# EAGLE design circuito_control (EAGLE 6.5.0)
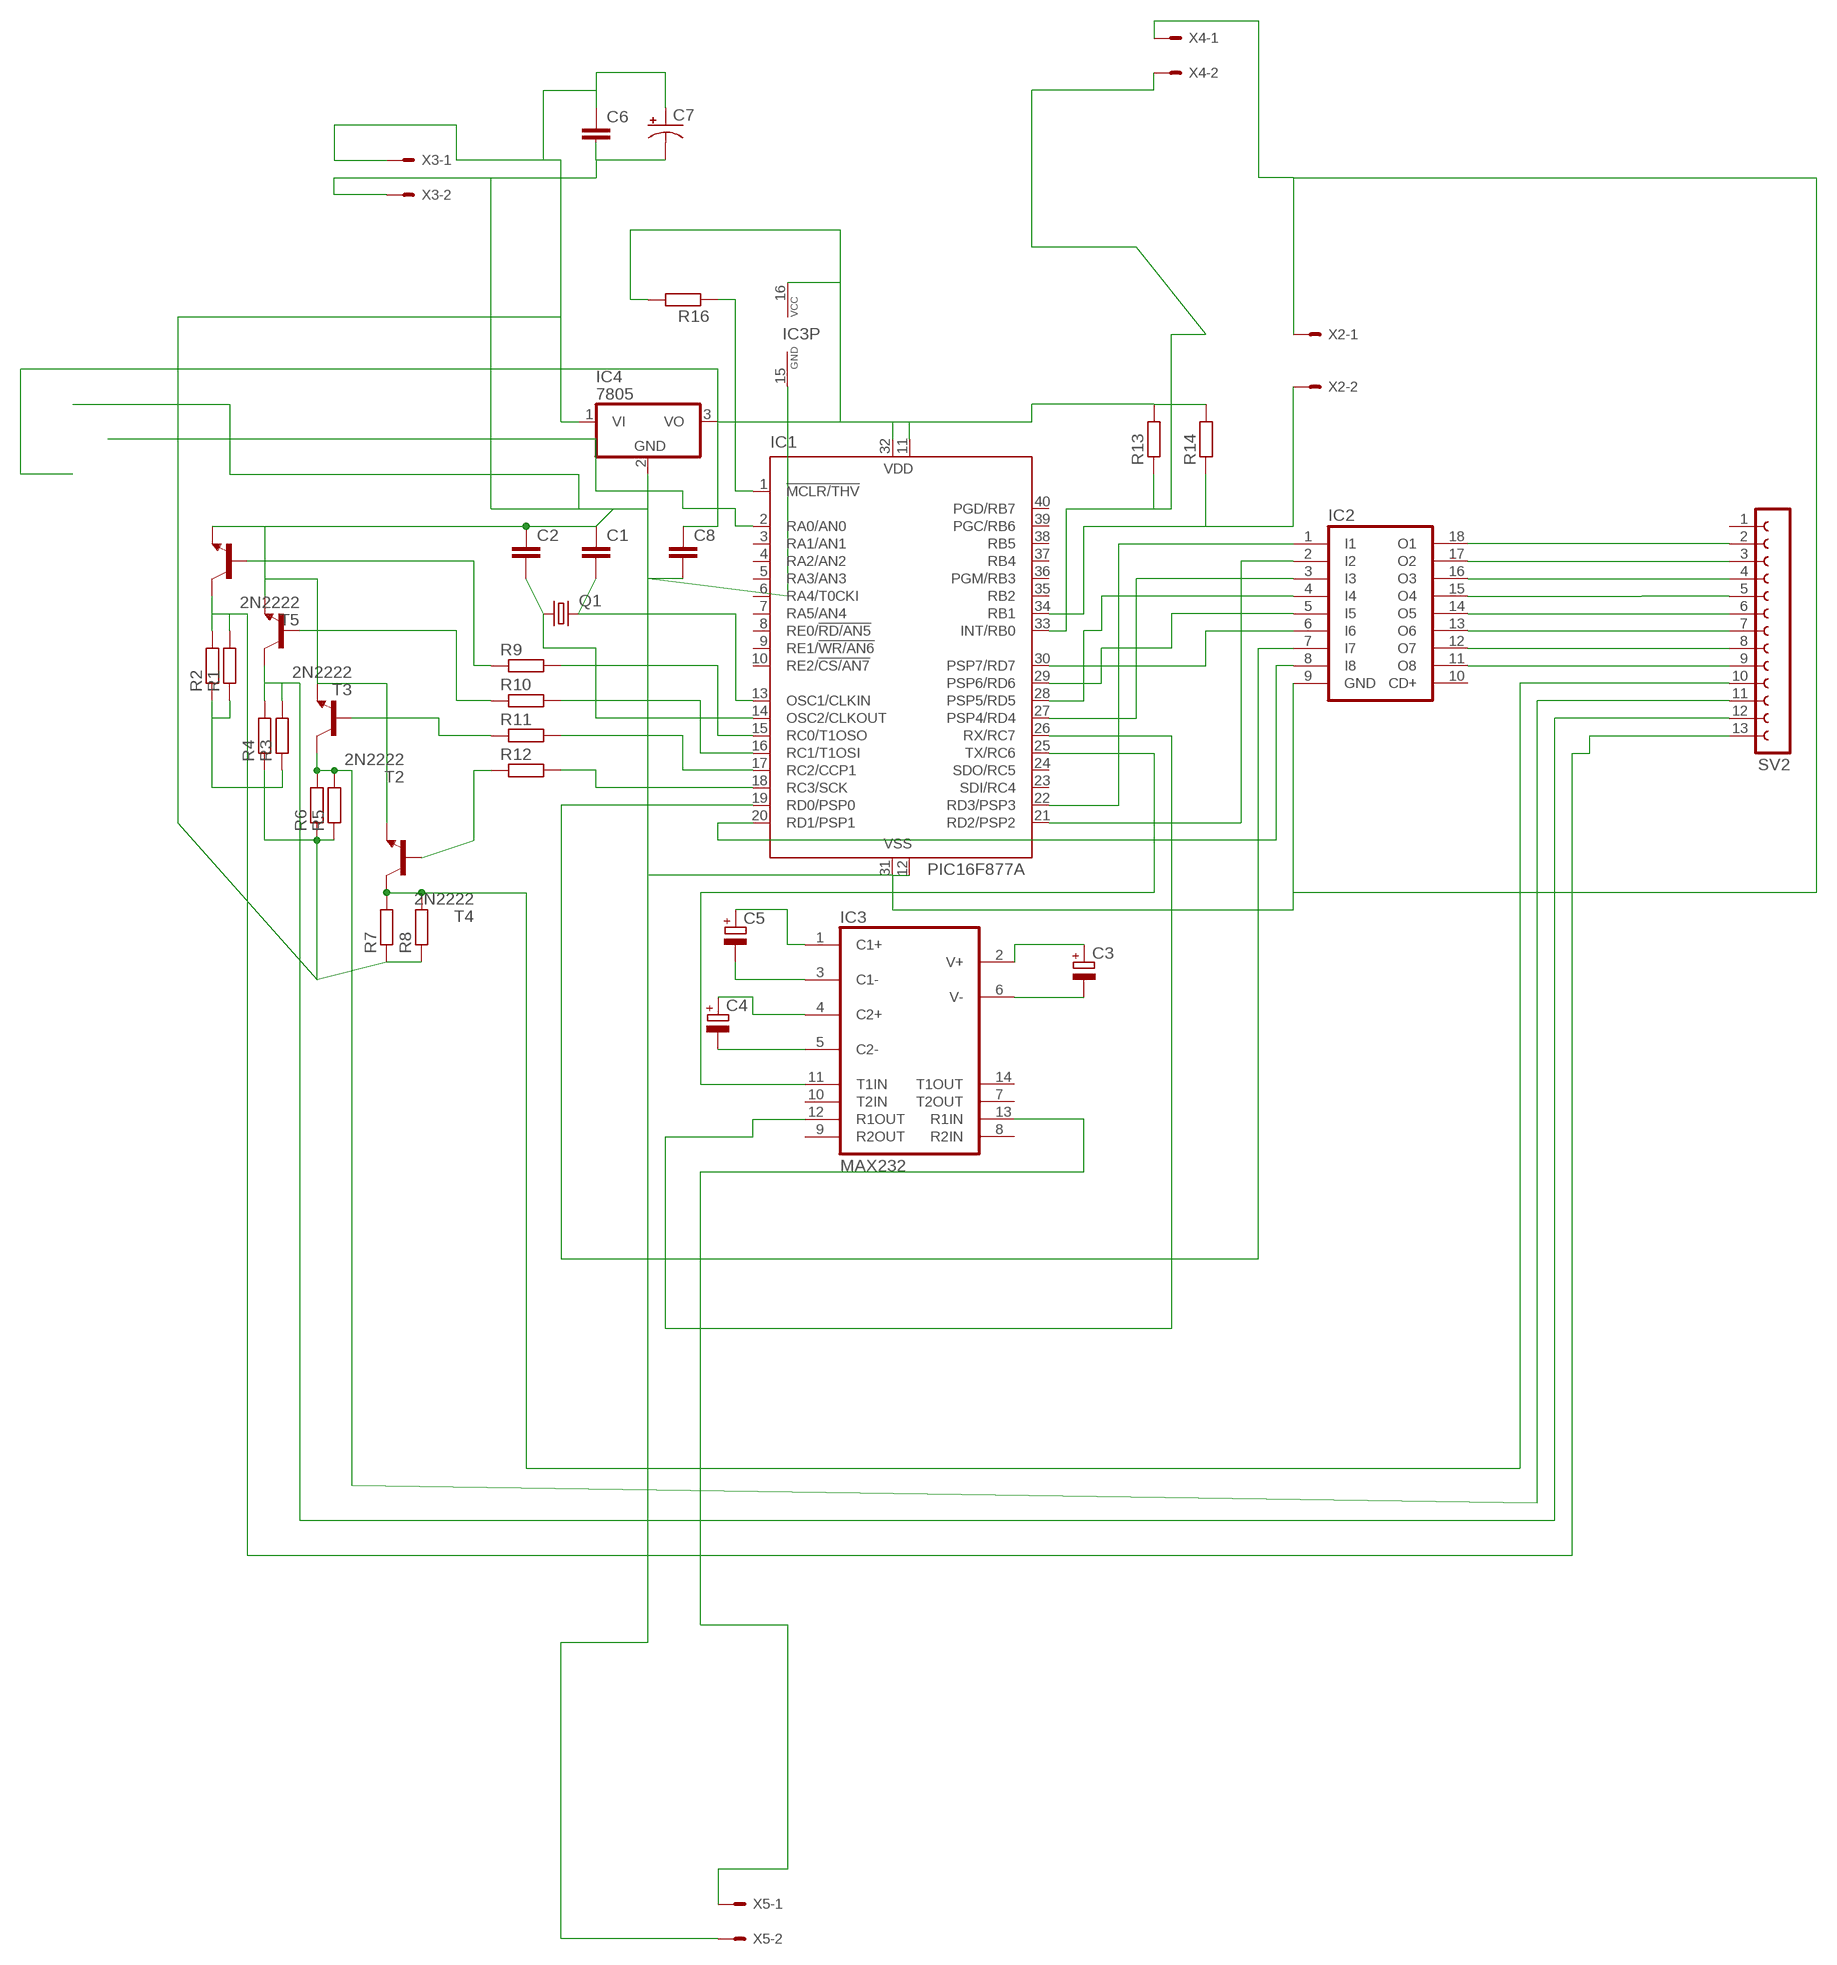
[diagram p0: schematic, sheet 1]

## Parts
C1  C-EU025-025X050  [C025-025X050]
C2  C-EU025-025X050  [C025-025X050]
C3  CPOL-EUE1.8-4  [E1,8-4]
C4  CPOL-EUE1.8-4  [E1,8-4]
C5  CPOL-EUE1.8-4  [E1,8-4]
C6  C-EU025-025X050  [C025-025X050]
C7  CPOL-USE5-10.5  [E5-10,5]
C8  C-EU025-025X050  [C025-025X050]
IC1  PIC16F877A  PIC16F877P  [DIL40]
IC2  ULN2803A  [DIL18]
IC3  MAX232  [DIL16]
IC4  7805  7805TV  [TO220V]
Q1  CRYSTALHC49U70  [HC49U70]
R1  R-EU_0411/15  [0411/15]
R2  R-EU_0411/15  [0411/15]
R3  R-EU_0411/15  [0411/15]
R4  R-EU_0411/15  [0411/15]
R5  R-EU_0411/15  [0411/15]
R6  R-EU_0411/15  [0411/15]
R7  R-EU_0411/15  [0411/15]
R8  R-EU_0411/15  [0411/15]
R9  R-EU_0207/7  [0207/7]
R10  R-EU_0207/7  [0207/7]
R11  R-EU_0207/7  [0207/7]
R12  R-EU_0207/7  [0207/7]
R13  R-EU_0207/7  [0207/7]
R14  R-EU_0207/7  [0207/7]
R16  R-EU_0207/7  [0207/7]
SV2  FE13-1  [FE13]
T2  2N2222  [TO18]
T3  2N2222  [TO18]
T4  2N2222  [TO18]
T5  2N2222  [TO18]
X2  KK-156-2  [KK-156-2]
X3  KK-156-2  [KK-156-2]
X4  KK-156-2  [KK-156-2]
X5  KK-156-2  [KK-156-2]

## Nets
N$1: C6.1 C7.+ IC4.1(VI) R1.1 R2.1 R3.1 R4.1 R5.1 R6.1 R7.1 R8.1 X3.1
N$2: IC1.1(!MCLR/THV) R16.1
N$4: IC3.13(R1IN) X5.1
N$6: C3.- IC3.6(V-)
N$7: C3.+ IC3.2(V+)
N$8: C4.+ IC3.4(C2+)
N$9: C4.- IC3.5(C2-)
N$10: C5.- IC3.3(C1-)
N$11: C5.+ IC3.1(C1+)
N$12: IC1.25(TX/RC6) IC3.11(T1IN)
N$13: IC1.26(RX/RC7) IC3.12(R1OUT)
N$14: IC1.22(RD3/PSP3) IC2.1(I1)
N$15: IC1.21(RD2/PSP2) IC2.2(I2)
N$16: IC1.28(PSP5/RD5) IC2.4(I4)
N$17: IC1.20(RD1/PSP1) IC2.8(I8)
N$18: IC1.29(PSP6/RD6) IC2.5(I5)
N$19: IC1.30(PSP7/RD7) IC2.6(I6)
N$20: IC1.27(PSP4/RD4) IC2.3(I3)
N$22: IC1.15(RC0/T1OSO) R9.2
N$23: IC1.16(RC1/T1OSI) R10.2
N$24: IC1.17(RC2/CCP1) R11.2
N$25: IC1.18(RC3/SCK) R12.2
N$26: R9.1 T5.2(B)
N$27: R10.1 T3.2(B)
N$28: R11.1 T2.2(B)
N$29: R12.1 T4.2(B)
N$30: R7.2 R8.2 SV2.10 T4.3(C)
N$31: R5.2 R6.2 SV2.11 T2.3(C)
N$32: R3.2 R4.2 SV2.12 T3.3(C)
N$33: R1.2 R2.2 SV2.13 T5.3(C)
N$36: C2.2 IC1.14(OSC2/CLKOUT) Q1.1
N$37: IC2.18(O1) SV2.2
N$38: IC2.17(O2) SV2.3
N$40: IC1.34(RB1) R14.1 X2.2
N$41: C8.1 IC1.11(VDD) IC1.32(VDD) IC3.16(VCC) IC4.3(VO) R13.2 R14.2 R16.2
N$42: C1.2 IC1.13(OSC1/CLKIN) Q1.2
N$43: IC1.2(RA0/AN0)
N$44: IC2.16(O3) SV2.4
N$45: IC2.15(O4) SV2.5
N$46: IC2.14(O5) SV2.6
N$47: IC2.13(O6) SV2.7
N$48: IC2.12(O7) SV2.8
N$49: IC2.11(O8) SV2.9
N$57: IC1.33(INT/RB0) R13.1 X4.2
N$60: C1.1 C2.1 C6.2 C7.- C8.2 IC1.12(VSS) IC1.31(VSS) IC2.9(GND) IC3.15(GND) IC4.2(GND) T2.1(E) T3.1(E) T4.1(E) T5.1(E) X2.1 X3.2 X4.1 X5.2
N$67: IC1.19(RD0/PSP0) IC2.7(I7)
Unconnected: IC1.3(RA1/AN1) IC1.4(RA2/AN2) IC1.5(RA3/AN3) IC1.6(RA4/T0CKI) IC1.7(RA5/AN4) IC1.8(RE0/!RD/AN5) IC1.9(RE1/!WR/AN6) IC1.10(RE2/!CS/AN7) IC1.23(SDI/RC4) IC1.24(SDO/RC5) IC1.35(RB2) IC1.36(PGM/RB3) IC1.37(RB4) IC1.38(RB5) IC1.39(PGC/RB6) IC1.40(PGD/RB7) IC2.10(CD+) IC3.7(T2OUT) IC3.8(R2IN) IC3.9(R2OUT) IC3.10(T2IN) IC3.14(T1OUT) SV2.1

## Library data of the parts
C1 C2 C6 C8 = rcl:C-EU: CAPACITOR, European symbol
C3-C5 = resistor:CPOL-EU: POLARIZED CAPACITOR, European symbol
C7 = rcl:CPOL-US: POLARIZED CAPACITOR, American symbol
IC1 = microchip:PIC16F87*: MICROCONTROLLER; MF: MICROCHIP; MPN: PIC16F877-04/P; OC_FARNELL: 9761349; OC_NEWARK: 61K3463
IC2 = uln-udn:ULN2803A: DRIVER ARRAY
IC3 = maxim:MAX232: RS232 TRANSEIVER; MF: MAXIM; MPN: MAX232ACPE+; OC_FARNELL: 9723773; OC_NEWARK: 68K4544
IC4 = linear:78*: Positive VOLTAGE REGULATOR Source: http://cache.national.com/ds/LM/LM78L05.pdf http://www.fairchildsemi.com/ds/LM/LM7805.pdf
Q1 = crystal:CRYSTAL: CRYSTAL; OC_FARNELL: unknown; OC_NEWARK: unknown
R1-R8 = rcl:R-EU_: RESISTOR, European symbol
R9-R14 R16 = resistor:R-EU_: RESISTOR, European symbol
SV2 = con-lsta:FE13-1: FEMALE HEADER; OC_FARNELL: unknown; OC_NEWARK: unknown
T2-T5 = transistor:2N2222: NPN TRANSISTOR
X2-X5 = con-molex:KK-156-2: KK 156 HEADER Source: http://www.molex.com/pdm_docs/sd/026604100_sd.pdf; OC_FARNELL: unknown; OC_NEWARK: unknown

## Board
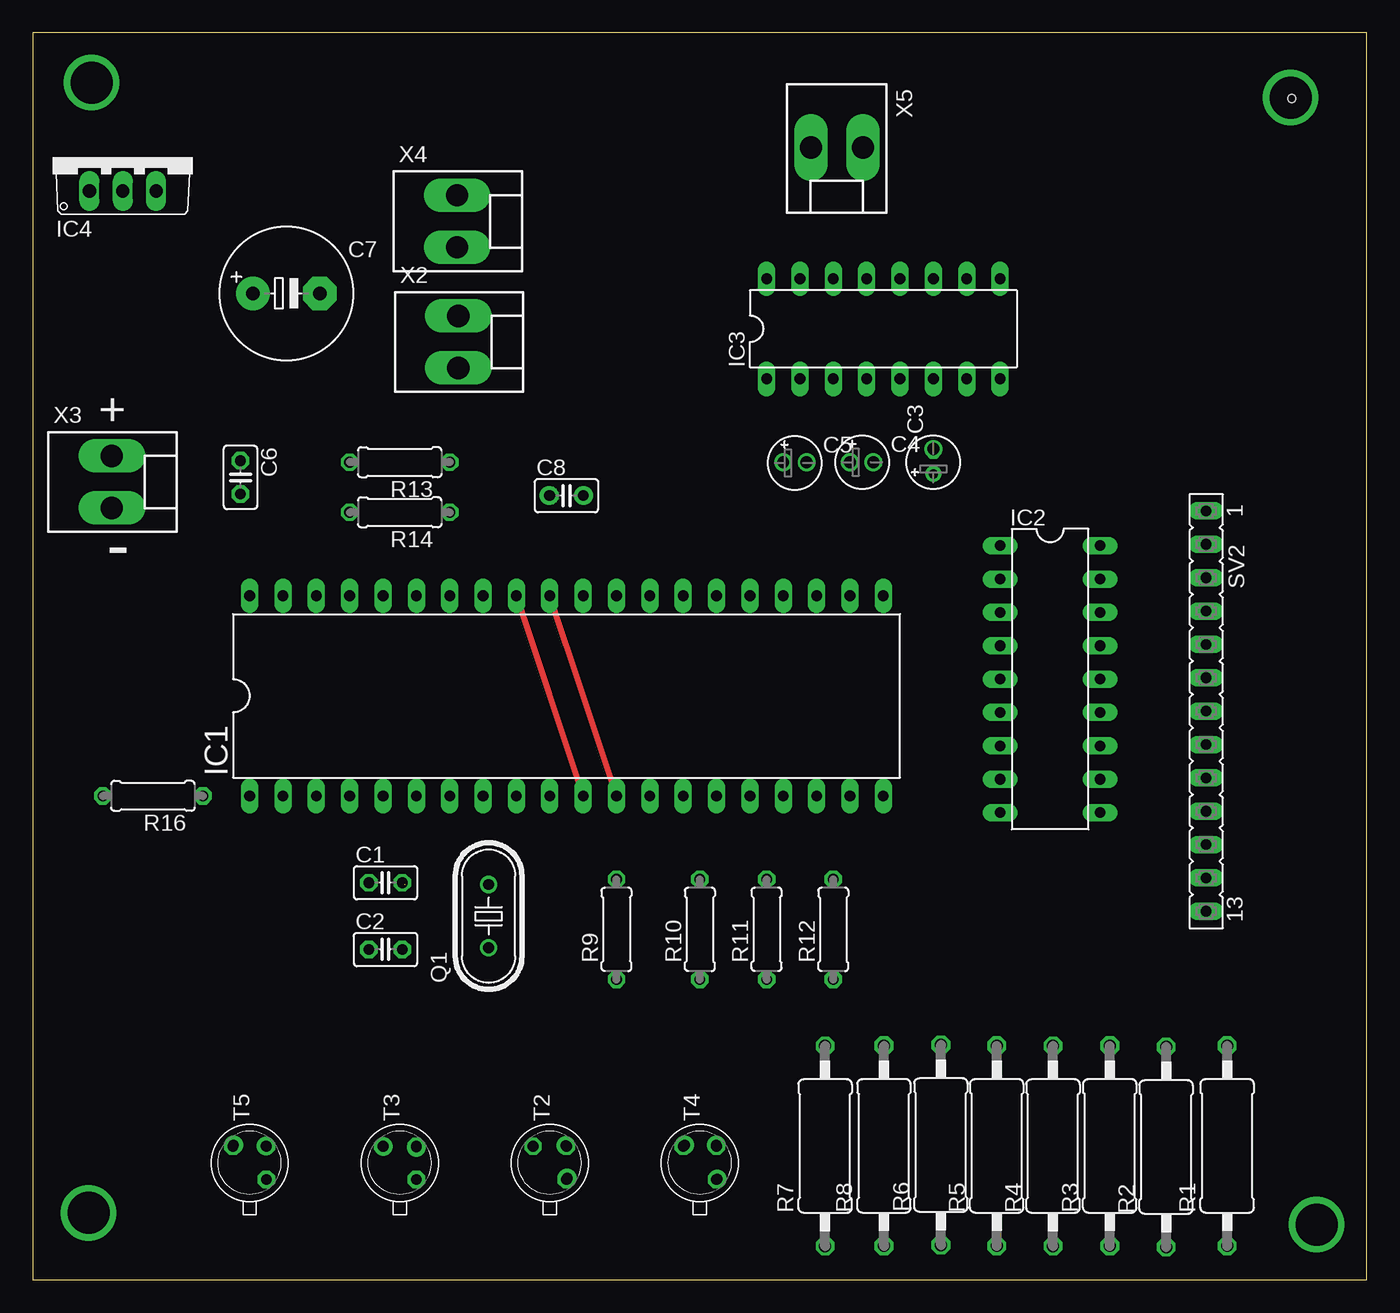
[diagram p1: board, top side]
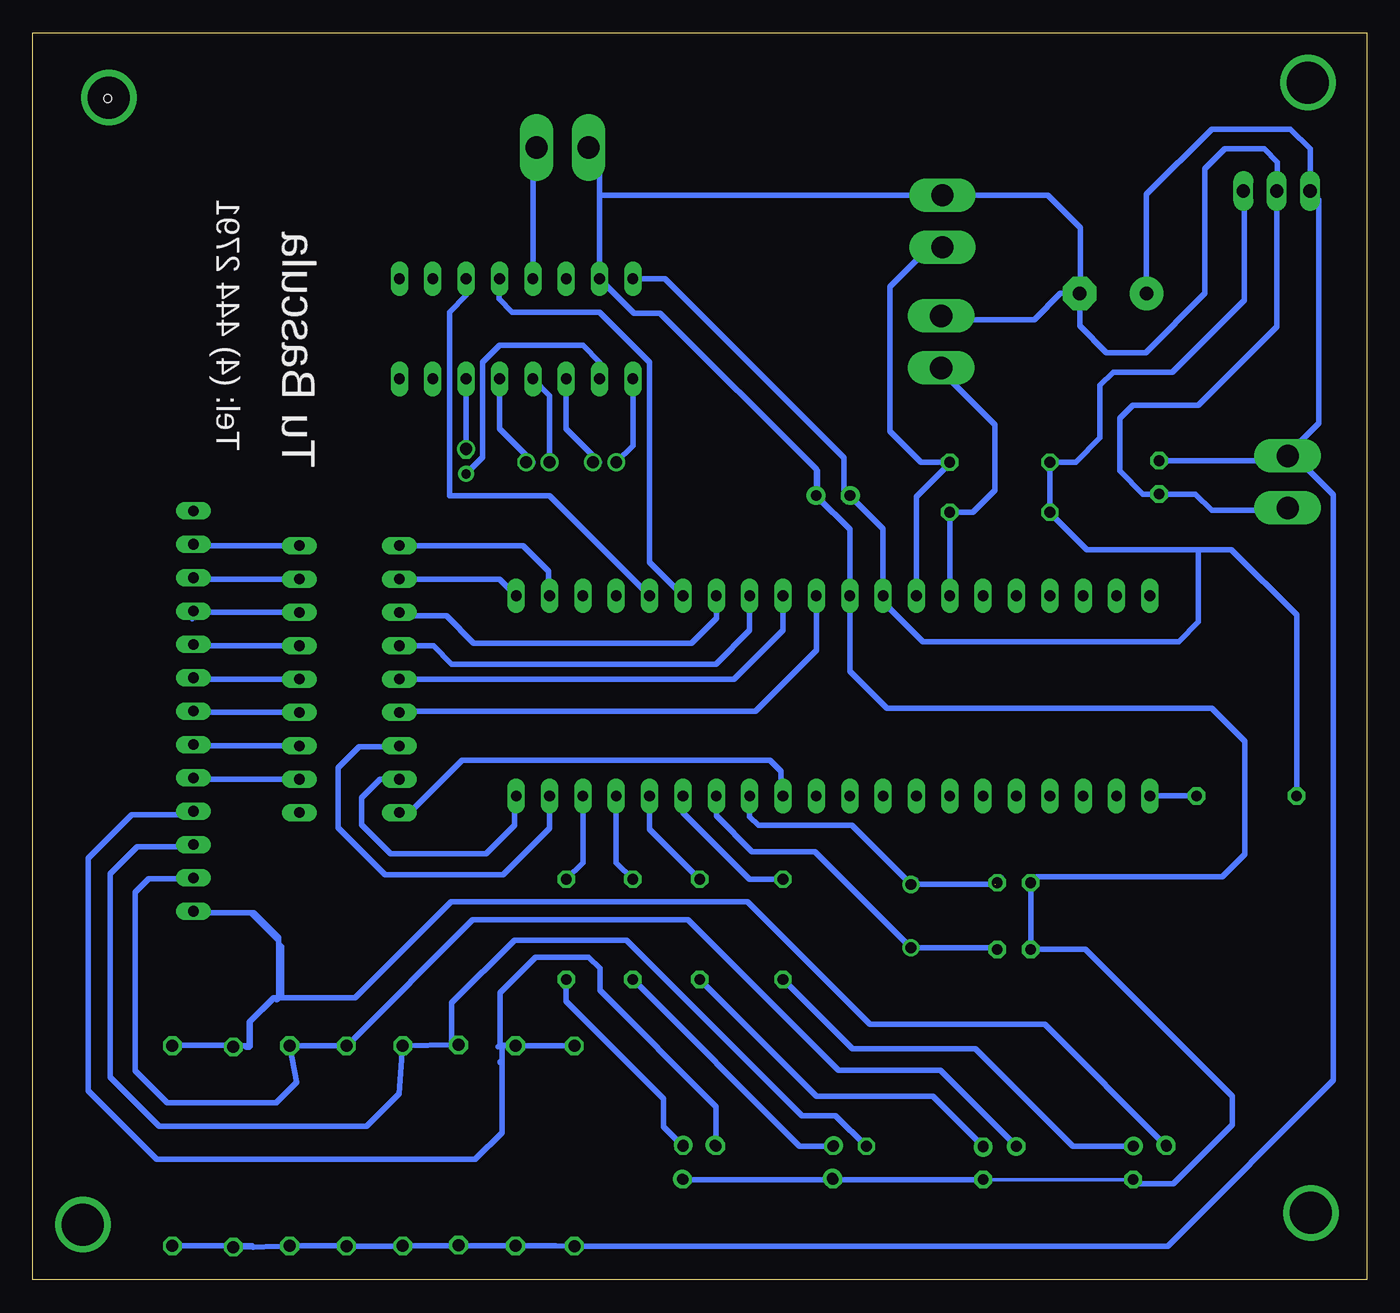
[diagram p2: board, bottom side, seen from below]

Size 101.58 x 94.92 mm. Coordinates in mm from the lower left corner, seen from the top.
Outline: 0,0 101.58,0 101.58,94.92 0,94.92 0,0
Copper layers (1*16): Top 0.035mm / dielectric 1.5mm / Bottom 0.035mm
Design rules "default": minimum track width 10mil, minimum drill 24mil, track to track 8mil, track to pad 8mil, pad to pad 8mil, via to via 8mil, smd to smd 8mil, copper to edge 40mil, drill to drill 8mil, minimum pad ring 10mil, minimum via ring 8mil, stop-mask expansion 4mil, vias tented up to drill 0mil, thermal gap 10mil
Holes 0.6 mm at 95.89,89.92

### Footprints (pad centres in the part's own frame; a part is rotated, then mirrored left to right if it is on the bottom)
C025-025X050 = drill 0.813 octagon: 1 -1.27,0; 2 1.27,0
E1,8-4 = drill 0.711 pad 1.168: + -0.889,0 | drill 0.711 pad 1.168 octagon: - 0.889,0
E5-10,5 = drill 1.016 pad 2.54: + -2.54,0 | drill 1.016 pad 2.54 octagon: - 2.54,0
DIL40 = drill 0.813 long: 1 -24.13,-7.62; 2 -21.59,-7.62; 3 -19.05,-7.62; 4 -16.51,-7.62; 5 -13.97,-7.62; 6 -11.43,-7.62; 7 -8.89,-7.62; 8 -6.35,-7.62; 9 -3.81,-7.62; 10 -1.27,-7.62; 11 1.27,-7.62; 12 3.81,-7.62; 13 6.35,-7.62; 14 8.89,-7.62; 15 11.43,-7.62; 16 13.97,-7.62; 17 16.51,-7.62; 18 19.05,-7.62; 19 21.59,-7.62; 20 24.13,-7.62; 21 24.13,7.62; 22 21.59,7.62; 23 19.05,7.62; 24 16.51,7.62; 25 13.97,7.62; 26 11.43,7.62; 27 8.89,7.62; 28 6.35,7.62; 29 3.81,7.62; 30 1.27,7.62; 31 -1.27,7.62; 32 -3.81,7.62; 33 -6.35,7.62; 34 -8.89,7.62; 35 -11.43,7.62; 36 -13.97,7.62; 37 -16.51,7.62; 38 -19.05,7.62; 39 -21.59,7.62; 40 -24.13,7.62
DIL18 = drill 0.813 long: 1 -10.16,-3.81; 2 -7.62,-3.81; 3 -5.08,-3.81; 4 -2.54,-3.81; 5 0,-3.81; 6 2.54,-3.81; 7 5.08,-3.81; 8 7.62,-3.81; 9 10.16,-3.81; 10 10.16,3.81; 11 7.62,3.81; 12 5.08,3.81; 13 2.54,3.81; 14 0,3.81; 15 -2.54,3.81; 16 -5.08,3.81; 17 -7.62,3.81; 18 -10.16,3.81
DIL16 = drill 0.813 long: 1 -8.89,-3.81; 2 -6.35,-3.81; 3 -3.81,-3.81; 4 -1.27,-3.81; 5 1.27,-3.81; 6 3.81,-3.81; 7 6.35,-3.81; 8 8.89,-3.81; 9 8.89,3.81; 10 6.35,3.81; 11 3.81,3.81; 12 1.27,3.81; 13 -1.27,3.81; 14 -3.81,3.81; 15 -6.35,3.81; 16 -8.89,3.81
TO220V = drill 1.016 long: 1 -2.54,-2.54; 2 0,-2.54; 3 2.54,-2.54
HC49U70 = drill 0.813: 1 -2.413,0; 2 2.413,0
0411/15 = drill 0.914 octagon: 1 -7.62,0; 2 7.62,0
0207/7 = drill 0.813 octagon: 1 -3.81,0; 2 3.81,0
FE13 = drill 0.813 long: 1 -15.24,0; 2 -12.7,0; 3 -10.16,0; 4 -7.62,0; 5 -5.08,0; 6 -2.54,0; 7 0,0; 8 2.54,0; 9 5.08,0; 10 7.62,0; 11 10.16,0; 12 12.7,0; 13 15.24,0
TO18 = drill 0.813 octagon: 1 -1.27,-1.27; 2 1.27,-1.27; 3 1.27,1.27
KK-156-2 = drill 1.7 pad 2.184 long: 1 -1.98,0; 2 1.98,0

### Placement (x,y rotation side)
C1  26.86,30.22 0 top
C2  26.86,25.14 0 top
C3  68.58,62.23 90 top
C4  63.17,62.23 0 top
C5  58.01,62.18 0 top
C6  15.81,61.08 270 top
C7  19.31,75.08 0 top
C8  40.64,59.69 0 top
IC1  40.64,44.45 0 top
IC2  77.47,45.72 270 top
IC3  64.77,72.39 0 top
IC4  6.85,85.43 0 top
Q1  34.71,27.68 90 top
R1  90.96,10.19 90 top
R2  86.31,10.1 90 top
R3  82.02,10.19 90 top
R4  77.69,10.17 90 top
R5  73.41,10.19 90 top
R6  69.16,10.25 90 top
R7  60.34,10.17 90 top
R8  64.82,10.19 90 top
R9  44.45,26.67 90 top
R10  50.8,26.67 90 top
R11  55.88,26.67 90 top
R12  60.96,26.67 90 top
R13  27.94,62.23 180 top
R14  27.94,58.42 180 top
R16  9.14,36.83 180 top
SV2  89.36,43.28 270 top
T2  39.37,8.89 90 top
T3  27.94,8.89 90 top
T4  50.8,8.89 90 top
T5  16.51,8.89 90 top
X2  32.4,71.39 270 top
X3  6.01,60.73 270 top
X4  32.31,80.58 270 top
X5  61.24,86.18 180 top

### Tracks (layer width: path | path; a pad name or v marks a point on that pad's centre or on a via)
N$1
  Bottom 0.254: 5.08,63.5 X3.1 5.08,62.23 | 3.81,82.55 IC4.1 | 5.08,62.23 2.54,59.69 | 5.08,62.23 5.04,62.27 | 85.09,2.56 85.09,2.54 R2.1 | 73.66,2.56 73.66,2.54 R5.1
  Bottom 0.406: C6.1 6.37,62.35 X3.1 | IC4.1 4.31,86.08 5.81,87.58 11.81,87.58 16.77,82.62 C7.+ | IC4.1 | 5.59,62.81 5.04,62.27 2.54,59.77 2.54,15.16 15.15,2.56 R7.1 61.77,2.56 R8.1 69.78,2.56 | 5.08,63.5 5.08,63.75 3.63,65.2 3.63,82.21 IC4.1 | 85.15,2.56 R2.1 81.49,2.56 R3.1 77.7,2.56 R4.1 73.66,2.56 73.19,2.56 73.05,2.41 | R1.1 85.09,2.56 84.89,2.56 84.78,2.46 | R5.1 69.78,2.56 | 69.78,2.56 R6.1
N$2
  Bottom 0.254: R16.1 12.7,36.83 12.79,36.92
  Bottom 0.406: IC1.1 R16.1 12.88,36.83 12.79,36.92 12.72,36.98
N$3  (via drill 3.2 pad 1.02)
  other vias: 95.78,89.99
N$4
  Bottom 0.406: IC3.13 63.5,85.09 X5.1
N$5  (via drill 3.2 pad 1.02)
  other vias: 97.76,4.19
N$6  (via drill 0.9 pad 0.25)
  Bottom 0.406: IC3.6 v68.58,63.25 C3.-
N$7
  Bottom 0.254: 68.58,60.96 C3.+
  Bottom 0.406: C3.+ 67.31,62.61 67.31,69.85 66.04,71.12 59.69,71.12 58.42,69.85 IC3.2
N$8  (via drill 0.9 pad 0.25)
  Bottom 0.254: v62.23,62.23 C4.+
  Bottom 0.406: v62.23,62.23 62.23,67.31 IC3.4
N$9  (via drill 0.9 pad 0.25)
  Bottom 0.254: 63.5,62.23 v64.01,62.23 C4.-
  Bottom 0.406: 63.5,62.23 66.04,64.77 IC3.5
N$10
  Bottom 0.254: 58.42,62.23 C5.-
  Bottom 0.406: 58.42,62.23 60.96,64.77 IC3.3
N$11  (via drill 0.9 pad 0.25)
  Bottom 0.254: v57.15,62.23 C5.+
  Bottom 0.406: v57.15,62.23 55.88,63.5 IC3.1
N$12
  Bottom 0.406: IC1.25 62.23,59.69 69.85,59.69 69.85,73.66 68.58,74.93 IC3.11
N$13
  Bottom 0.406: IC1.26 54.61,54.61 54.61,69.85 58.42,73.66 65.08,73.66 66.09,74.68 66.09,76.15 IC3.12
N$14
  Bottom 0.406: IC1.22 62.23,51.82 62.31,51.74 62.31,53.95 64.24,55.88 IC2.1
N$15
  Bottom 0.406: IC2.2 66.04,53.34 IC1.21
N$16
  Bottom 0.406: IC1.28 46.99,49.43 49.55,46.86 69.67,46.86 71.07,48.26 IC2.4
N$17
  Bottom 0.406: IC2.8 75.13,38.1 76.56,36.68 76.56,34.62 74.35,32.41 67.08,32.41 64.9,34.59 64.9,36.7 IC1.20
N$18
  Bottom 0.406: IC2.5 48.18,45.72 44.45,49.45 IC1.29
N$19
  Bottom 0.406: IC1.30 41.91,47.93 46.56,43.28 73.56,43.28 IC2.6
N$20
  Bottom 0.406: IC1.27 49.53,50.37 51.44,48.46 68,48.46 70.08,50.55 73.41,50.55 IC2.3
N$22
  Bottom 0.406: R9.2 46.99,30.48 52.07,35.56 IC1.15
N$23
  Bottom 0.406: R10.2 54.61,34.29 IC1.16
N$24
  Bottom 0.406: R11.2 57.15,31.75 IC1.17
N$25
  Bottom 0.406: R12.2 59.69,31.75 IC1.18
N$26
  Bottom 0.406: T5.2 22.39,10.16 29.81,17.58 39.17,17.58 R9.1
N$27
  Bottom 0.406: T3.2 33.02,13.97 41.91,13.97 R10.1
N$28
  Bottom 0.406: T2.2 43.18,10.16 R11.1
N$29
  Bottom 0.406: R12.1 60.96,21.18 53.57,13.79 53.57,11.66 T4.2
N$30
  Bottom 0.254: 65.99,16.56 66.04,16.51 65.86,16.51 | 66.04,17.78 65.86,17.78 | 66.04,17.78 R8.2 | 66.04,17.78 66.02,17.86
  Bottom 0.406: 65.95,16.52 65.99,16.56 66.02,16.59 | T4.3 49.55,10.19 49.55,13.18 58.4,22.02 58.4,23.7 59.26,24.56 63.3,24.56 66.02,21.84 66.02,17.86 65.94,17.78 | R7.2 65.82,17.8 65.84,17.78 65.86,17.78 | 65.86,17.78 65.94,17.78 | 65.94,17.78 66.04,17.78 66.09,17.78 66.14,17.73 | 65.86,17.78 65.86,16.51 65.86,11.2 67.84,9.22 67.84,9.17 92.15,9.17 97.36,14.38 97.36,32.08 94.06,35.38 89.64,35.38 SV2.10 | 65.86,17.78 R8.2 65.96,17.88
N$31
  Bottom 0.254: 69.69,17.86 69.85,17.78 R6.2
  Bottom 0.406: T2.3 40.44,12.5 43,12.5 56.36,25.86 64.9,25.86 69.69,21.06 69.69,17.86 69.7,17.86 | R6.2 73.67,17.8 R5.2 73.69,14.15 76.15,11.68 91.97,11.68 95.68,15.39 95.68,30.89 93.62,32.94 89.53,32.94 SV2.11
N$32
  Bottom 0.254: R4.2 77.47,17.78 77.58,17.89
  Bottom 0.406: T3.3 32.46,15.95 40.23,15.95 51.69,27.41 68.07,27.41 77.58,17.89 R4.2 | 83.01,13.49 83.03,13.49 | 83.03,13.49 91.36,13.49 93.78,15.9 93.78,29.49 92.76,30.51 89.43,30.51 SV2.12 | 83.03,13.49 81.48,15.04 R3.2 77.7,17.8 R4.2
N$33
  Bottom 0.254: 85.09,17.78 R2.2 | 88.9,27.94 SV2.13 | R1.2 91.44,17.78 90.17,17.78 90.17,17.83 | 85.09,27.94 82.55,25.4 82.55,21.46
  Bottom 0.406: T5.3 24.51,19.43 37.82,19.43 47.14,28.75 67.18,28.75 67.21,28.78 69.72,28.78 77.04,21.46 82.55,21.46 83.24,21.46 85.09,19.61 85.09,17.78 85.09,17.7 85.29,17.7 85.39,17.8 | 85.39,17.8 85.24,17.8 85.19,17.76 85.04,17.76 85.01,17.78 85.01,19.63 83.21,21.44 | 85.39,17.8 86.54,17.8 86.56,17.83 90.17,17.83 91.01,17.83 91.08,17.91 | 88.9,27.94 85.09,27.94 84.76,27.94 82.86,26.03 82.86,21.46 83.01,21.31
N$34  (via drill 3.2 pad 1.02)
  other vias: 4.47,91.14
N$35  (via drill 0.9 pad 0.25)
  other vias: 58.93,62.23
N$36
  Bottom 0.406: IC1.14 49.53,35.3 46.81,32.58 42.02,32.58 Q1.1 28.26,25.27 C2.2
N$37
  Bottom 0.254: SV2.2 90.17,55.88 90.04,55.88
  Bottom 0.406: IC2.18 90.04,55.88 90.04,56.18
N$38
  Bottom 0.254: 88.9,53.34 SV2.3
  Bottom 0.406: IC2.17 88.9,53.34 89.89,53.34 89.89,53.47
N$40
  Bottom 0.254: X2.2 31.75,68.58 31.78,68.55
  Bottom 0.406: IC1.34 R14.1 29.97,58.42 28.31,60.08 28.31,65.08 31.78,68.55 32.31,69.08
N$41  (via drill 0.6)
  Top 0.406: IC1.32 IC1.11
  Bottom 0.254: 22.86,57.15 22.87,57.14 | 8.89,82.55 IC4.3
  Bottom 0.406: IC3.16 53.43,76.2 39.81,62.58 39.81,60.13 C8.1 36.83,57.15 IC1.32 36.83,51.6 33.81,48.58 14.31,48.58 12.81,50.08 12.81,55.58 | 12.81,55.58 10.31,55.58 5.33,50.6 R16.2 | 12.81,55.58 21.31,55.58 22.87,57.14 24.13,58.4 | 24.13,58.4 24.31,58.58 | 24.13,58.4 R14.2 R13.2 22.16,62.23 20.31,64.08 20.31,68.08 19.31,69.08 14.81,69.08 9.31,74.58 9.31,82.81 IC4.3
  other vias: 39.37,59.69 39.37,59.69 39.37,59.69
N$42  (1 unrouted)
  Bottom 0.254: 34.29,30.48 Q1.2 | C1.2 27.94,30.48 27.92,30.47
  Bottom 0.406: IC1.13 46.99,35.26 46.31,34.58 39.2,34.58 Q1.2 28.3,30.09 27.92,30.47 27.81,30.58 | 28.32,30.09 28.31,30.08
N$44
  Bottom 0.254: 88.9,50.8 SV2.4
  Bottom 0.406: IC2.16 88.9,50.8 89.46,50.8 89.46,50.32
N$45
  Bottom 0.406: IC2.15 89.36,48.26 SV2.5
N$46
  Bottom 0.406: IC2.14 89.36,45.72 SV2.6
N$47
  Bottom 0.406: IC2.13 89.36,43.18 SV2.7
N$48
  Bottom 0.254: 88.9,40.64 SV2.8
  Bottom 0.406: IC2.12 88.9,40.64 89.89,40.64 89.89,40.84
N$49
  Bottom 0.406: IC2.11 89.36,38.1 SV2.9
N$52  (via drill 0.8 pad 1.42)
  other vias: 41.94,59.69
N$53  (via drill 0.8 pad 1.42)
  other vias: 39.32,59.69
N$55  (via drill 0.8 pad 1.42)
  other vias: 15.29,10.26
N$56  (via drill 0.8 pad 1.42)
  other vias: 17.75,10.19
N$57
  Bottom 0.254: R13.1 31.81,62.08
  Bottom 0.406: IC1.33 34.29,59.6 31.81,62.08 | R13.1 33.96,62.23 36.31,64.58 36.31,75.58 33.31,78.58 32.33,78.58 X4.2
N$58  (via drill 0.8 pad 1.42)
  other vias: 26.7,10.13
N$59  (via drill 0.8 pad 1.42)
  other vias: 29.21,10.08
N$60
  Top 0.406: IC1.31 IC1.12
  Bottom 0.254: 6.35,82.55 IC4.2 | 33.02,82.55 X4.1 | 25.4,30.48 C1.1 | T3.1 T5.1
  Bottom 0.406: T4.1 T2.1 T3.1 | C8.2 41.91,61.68 | 55.8,73.58 53.81,73.58 41.91,61.68 | 55.8,73.58 IC3.15 58.42,82.55 | 41.91,61.68 41.81,61.58 41.81,59.58 39.37,57.14 IC1.31 39.34,52.07 39.34,46.33 36.53,43.51 11.81,43.51 9.3,41 9.3,32.38 11,30.68 25.13,30.68 C1.1 | 55.8,73.58 55.81,73.58 58.31,76.08 | C1.1 25.59,25.36 25.31,25.08 | C1.1 C2.1 21.41,25.14 10.24,13.97 10.24,11.79 14.71,7.31 17.47,7.31 T5.1 | X3.2 6.18,58.58 11.81,58.58 13.04,59.81 C6.2 17.04,59.81 18.81,61.58 18.81,65.58 17.81,66.58 12.81,66.58 6.85,72.54 IC4.2 6.81,82.93 6.81,85.08 7.81,86.08 10.81,86.08 12.31,84.58 12.31,75.08 16.81,70.58 19.81,70.58 21.85,72.62 C7.- | C7.- 23.31,75.08 25.31,73.08 32.69,73.08 | 32.81,73.08 32.69,73.08 | 32.69,73.08 X2.1 | X4.1 24.29,82.56 21.81,80.08 21.81,75.12 C7.- | 58.42,82.55 58.42,85.09 X5.2 | 58.42,82.55 33.02,82.55 | IC2.9 72.87,35.56 68.89,39.55 45.44,39.55 44.6,38.71 44.6,36.98 IC1.12
N$61  (via drill 0.8 pad 1.42)
  other vias: 40.59,10.21
N$62  (via drill 0.8 pad 1.42)
  other vias: 40.69,7.72
N$63  (via drill 0.8 pad 1.42)
  other vias: 49.63,10.26
N$64  (via drill 0.8 pad 1.42)
  other vias: 52.04,10.26
N$65  (via drill 0.8 pad 1.42)
  other vias: 52.12,7.67
N$66  (via drill 3.2 pad 1.02)
  other vias: 4.24,5.08
N$67
  Bottom 0.406: IC1.19 62.23,34.37 65.79,30.81 74.75,30.81 78.33,34.39 78.33,38.99 76.73,40.59 73.71,40.59 IC2.7

### Text on the board
tNames: + | -
bNames: Tu Bascula | Tel: (4) 444 2791
tValues: l